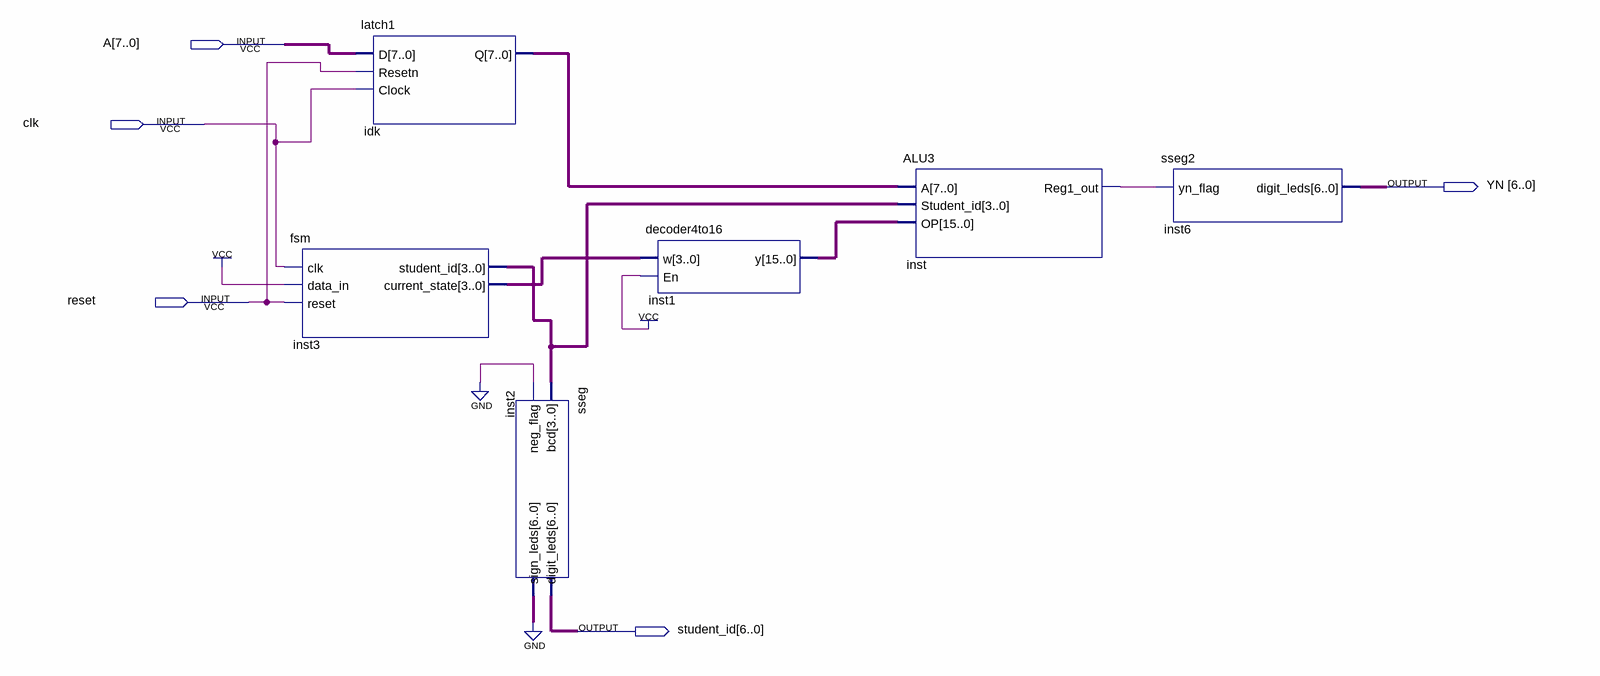
[diagram p0: schematic sheet]
// Quartus schematic ALU3BDF.bdf as structural Verilog: 6 symbols, 5 pins
module ALU3BDF (
  input  [7:0] A,
  input  clk,
  input  reset,
  output [6:0] YN,
  output [6:0] student_id
);

  wire inst_reg1_out;
  wire [3:0] inst3_current_state, inst3_student_id;
  wire [6:0] inst2_sign_leds;
  wire [7:0] idk_q;
  wire [15:0] inst1_y;

  fsm inst3 (
    .clk(clk), .data_in(1'b1), .reset(reset), .student_id(inst3_student_id),
    .current_state(inst3_current_state));
  latch1 idk (.D(A), .Resetn(reset), .Clock(clk), .Q(idk_q));
  sseg inst2 (.bcd(inst3_student_id), .neg_flag(1'b0), .digit_leds(student_id), .sign_leds(inst2_sign_leds));
  decoder4to16 inst1 (.w(inst3_current_state), .En(1'b1), .y(inst1_y));
  ALU3 inst (.A(idk_q), .Student_id(inst3_student_id), .OP(inst1_y), .Reg1_out(inst_reg1_out));
  sseg2 inst6 (.yn_flag(inst_reg1_out), .digit_leds(YN));
  // also tied to GND on the sheet: {inst2_sign_leds[0], inst2_sign_leds[1], inst2_sign_leds[2], inst2_sign_leds[3], inst2_sign_leds[4], inst2_sign_leds[5], inst2_sign_leds[6]}
endmodule
